# EAGLE schematic BalanceTest (EAGLE 9.6.2)
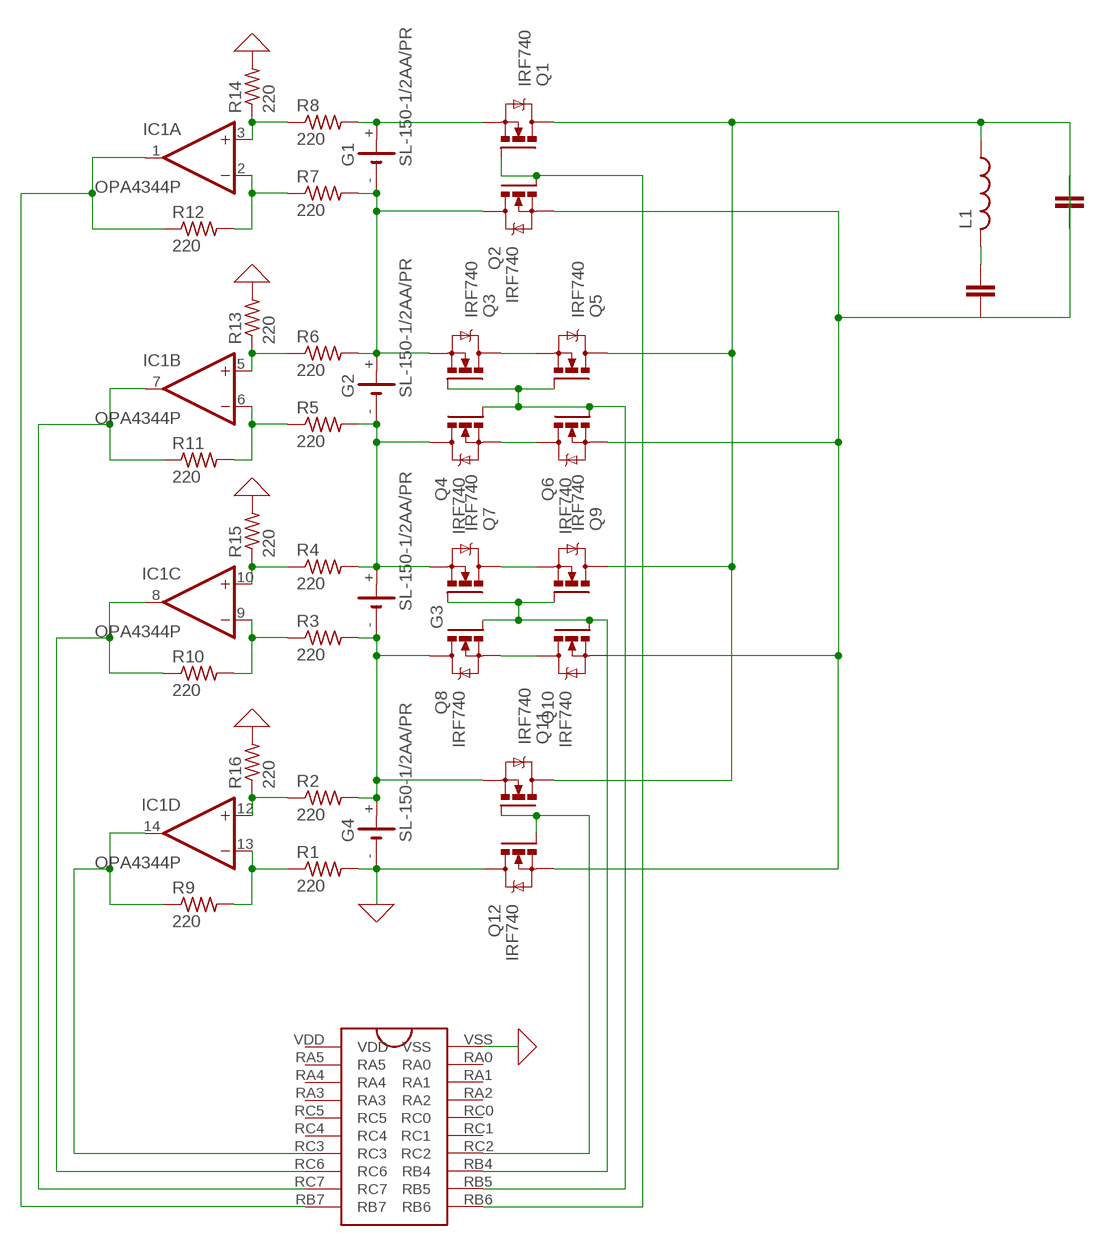
[diagram p0: schematic, sheet 1]

## Parts
G1  SL-150-1/2AA/PR  [SL-150-1/2AA/PR]
G2  SL-150-1/2AA/PR  [SL-150-1/2AA/PR]
G3  SL-150-1/2AA/PR  [SL-150-1/2AA/PR]
G4  SL-150-1/2AA/PR  [SL-150-1/2AA/PR]
IC1  OPA4344P  [DIL14]
L1  L-USIR-4  [IR-4]
Q1  IRF740  [TO220BV]
Q2  IRF740  [TO220BV]
Q3  IRF740  [TO220BV]
Q4  IRF740  [TO220BV]
Q5  IRF740  [TO220BV]
Q6  IRF740  [TO220BV]
Q7  IRF740  [TO220BV]
Q8  IRF740  [TO220BV]
Q9  IRF740  [TO220BV]
Q10  IRF740  [TO220BV]
Q11  IRF740  [TO220BV]
Q12  IRF740  [TO220BV]
R1  220  R-US_0411/15  [0411/15]
R2  220  R-US_0411/15  [0411/15]
R3  220  R-US_0411/15  [0411/15]
R4  220  R-US_0411/15  [0411/15]
R5  220  R-US_0411/15  [0411/15]
R6  220  R-US_0411/15  [0411/15]
R7  220  R-US_0411/15  [0411/15]
R8  220  R-US_0411/15  [0411/15]
R9  220  R-US_0411/15  [0411/15]
R10  220  R-US_0411/15  [0411/15]
R11  220  R-US_0411/15  [0411/15]
R12  220  R-US_0411/15  [0411/15]
R13  220  R-US_0411/15  [0411/15]
R14  220  R-US_0411/15  [0411/15]
R15  220  R-US_0411/15  [0411/15]
R16  220  R-US_0411/15  [0411/15]
U1  PIC18F15Q40SOIC  [SOIC]

## Nets
0: G4.- Q12.D R1.2 R13.2 R14.2 R15.2 R16.2 U1.VSS ; supply symbol labelled GND
N$1: G1.+ Q1.S R8.2
N$2: G1.- G2.+ Q2.D Q3.S R6.2 R7.2
N$3: Q3.D Q5.S
N$4: L1.2
N$5: Q3.G Q4.G Q5.G Q6.G U1.RB5
N$6: Q1.G Q2.G U1.RB6
N$7: Q11.G Q12.G U1.RC2
N$8: IC1.13(D:-IN) R1.1 R9.2
N$9: IC1.14(D:OUT) R9.1 U1.RC3
N$10: G2.- G3.+ Q4.D Q7.S R4.2 R5.2
N$11: G3.- G4.+ Q8.D Q11.S R2.2 R3.2
N$12: Q7.D Q9.S
N$13: Q4.S Q6.D
N$14: Q8.S Q10.D
N$16: L1.1 Q1.D Q2.S Q5.D Q6.S Q9.D Q10.S Q11.D Q12.S
N$17: IC1.8(C:OUT) R10.1 U1.RC6
N$18: IC1.7(B:OUT) R11.1 U1.RC7
N$19: IC1.1(A:OUT) R12.1 U1.RB7
N$20: IC1.12(D:+IN) R2.1 R16.1
N$21: Q7.G Q8.G Q9.G Q10.G U1.RB4
N$22: IC1.9(C:-IN) R3.1 R10.2
N$23: IC1.10(C:+IN) R4.1 R15.1
N$24: IC1.6(B:-IN) R5.1 R11.2
N$25: IC1.5(B:+IN) R6.1 R13.1
N$26: IC1.2(A:-IN) R7.1 R12.2
N$27: IC1.3(A:+IN) R8.1 R14.1
Unconnected: U1.RA0 U1.RA1 U1.RA2 U1.RA3 U1.RA4 U1.RA5 U1.RC0 U1.RC1 U1.RC4 U1.RC5 U1.VDD

## Power pins joined to a net without a drawn wire
V+: IC1.4(P:V+)
V-: IC1.11(P:V-)

## Library data of the parts
G1-G4 = battery:SL-150-1/2AA/PR: LI BATTERY Sonnenschein
IC1 = linear:OPA4*: Quad Operational Amplifier compatible with: TLC27L4 Low Power, Single-Supply, Rail-To-Rail Operational Amplifier Source: http://focus.ti.com/lit/ds/symlink/opa2345.pdf http://focus.ti.com .. opa241.pdf http://focus.ti.com .. tlc27l4.pdf http://focus.ti.com/lit/ds/symlink/opa2134.pdf
L1 = rcl:L-US: INDUCTOR, American symbol; SPICEPREFIX: L
Q1-Q12 = transistor-power:IRF740: N-CHANNEL MOS FET
R1-R16 = rcl:R-US_: RESISTOR, American symbol; SPICEPREFIX: R
U1 = PIC18F15Q40:PIC18F15Q40